# Altium schematic sheet Transceiver.SchDoc
size A3; Address1: Address1; Address2: Address2; Address3: Address3; Address4: Address4
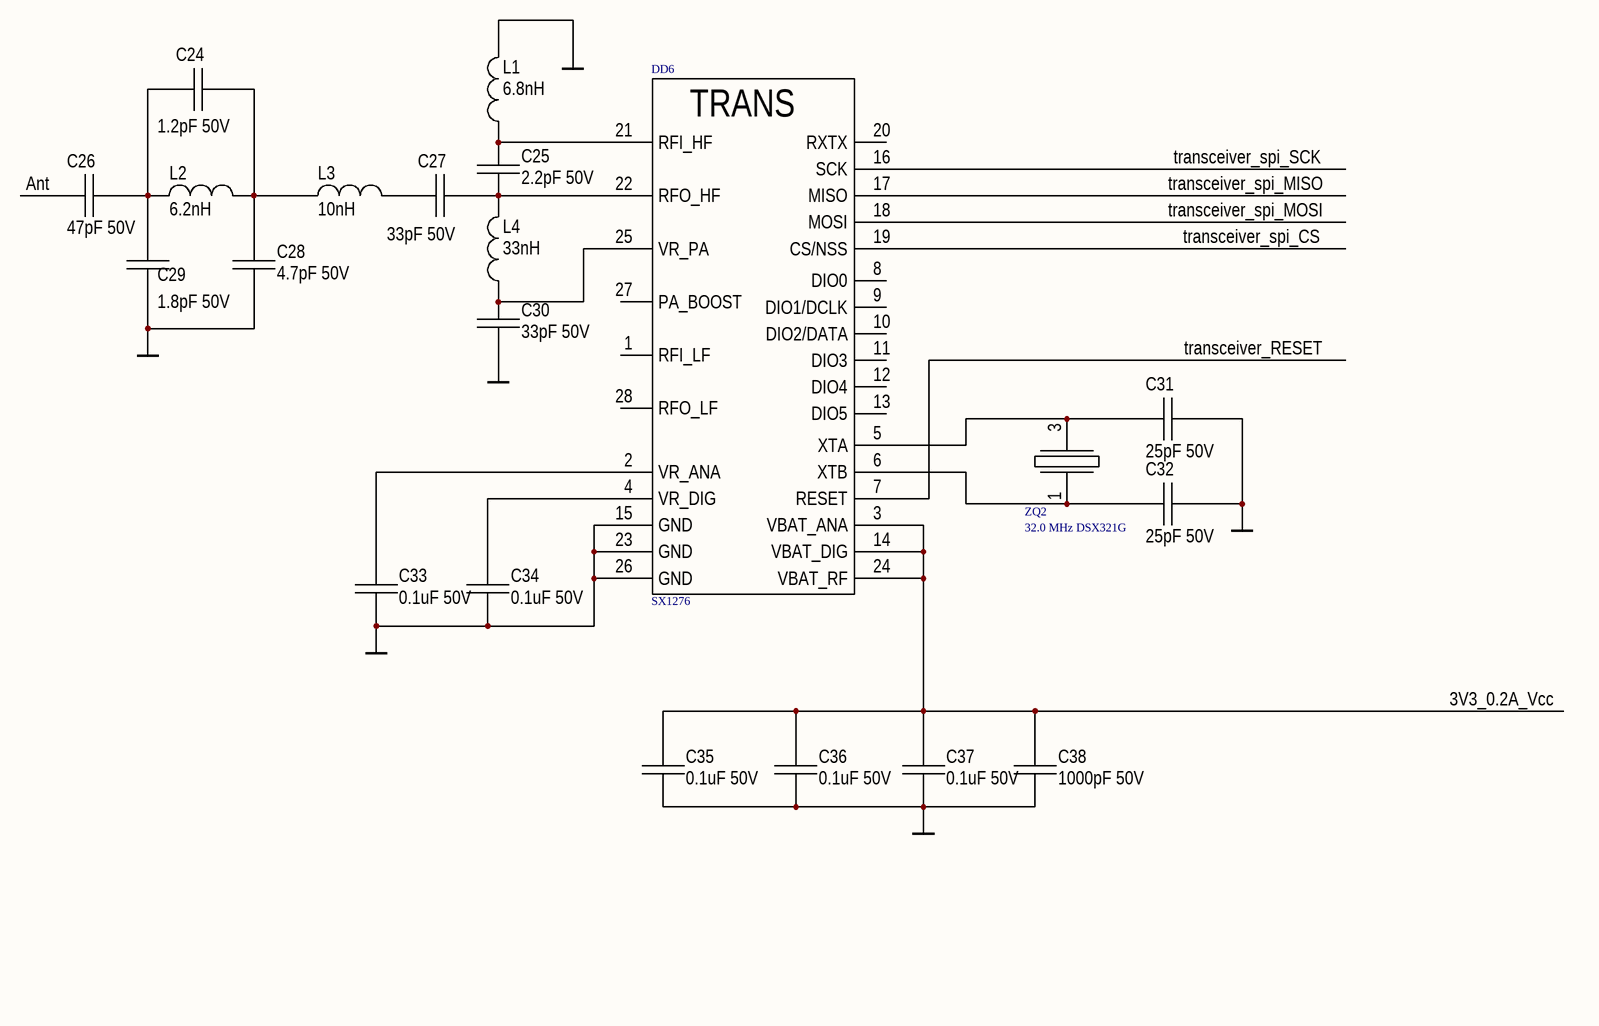
[diagram p0: Transceiver.SchDoc]

## Parts
C24  1.2pF 50V  [0603_CAP]
C25  2.2pF 50V  [0603_CAP]
C26  47pF 50V  [0603_CAP]
C27  33pF 50V  [0603_CAP]
C28  4.7pF 50V  [0603_CAP]
C29  1.8pF 50V  [0603_CAP]
C30  33pF 50V  [0603_CAP]
C31  25pF 50V  [0805_CAP]
C32  25pF 50V  [0805_CAP]
C33  0.1uF 50V  [0805_CAP]
C34  0.1uF 50V  [0805_CAP]
C35  0.1uF 50V  [0805_CAP]
C36  0.1uF 50V  [0805_CAP]
C37  0.1uF 50V  [0805_CAP]
C38  1000pF 50V  [0805_CAP]
DD6  SX1276  [qfn28]
L1  6.8nH  [0603_ind]
L2  6.2nH  [0603_ind]
L3  10nH  [0603_ind]
L4  33nH  [0603_ind]
ZQ2  32.0 MHz DSX321G  [gtxo-93]

## Nets
GND: C28.2 C29.1 C30.2 C31.2 C32.2 C33.1 C34.2 C35.2 C36.2 C37.2 C38.2 DD6.15(GND) DD6.23(GND) DD6.26(GND) L1.2
3V3_0.2A_Vcc: C35.1 C36.1 C37.1 C38.1 DD6.3(VBAT_ANA) DD6.14(VBAT_DIG) DD6.24(VBAT_RF)
Ant: C26.2
transceiver_RESET: DD6.7(RESET)
transceiver_spi_CS: DD6.19(CS/NSS)
transceiver_spi_MISO: DD6.17(MISO)
transceiver_spi_MOSI: DD6.18(MOSI)
transceiver_spi_SCK: DD6.16(SCK)
NetC24_1: C24.1 C26.1 C29.2 L2.1
NetC24_2: C24.2 C28.1 L2.2 L3.1
NetC25_1: C25.1 C27.1 DD6.22(RFO_HF) L4.2
NetC25_2: C25.2 DD6.21(RFI_HF) L1.1
NetC27_2: C27.2 L3.2
NetC30_1: C30.1 DD6.25(VR_PA) L4.1
NetC31_1: C31.1 DD6.5(XTA) ZQ2.3
NetC32_1: C32.1 DD6.6(XTB) ZQ2.1
NetC33_2: C33.2 DD6.2(VR_ANA)
NetC34_1: C34.1 DD6.4(VR_DIG)

Not connected (* = marked no-connect by the designer): DD6 1(RFI_LF) 8(DIO0) 9(DIO1/DCLK) 10(DIO2/DATA) 11(DIO3) 12(DIO4) 13(DIO5) 20(RXTX) 27(PA_BOOST) 28(RFO_LF)

## Notes on the sheet
- На место компонента С6 запаивается перемычка
- Title
- Size:
- Date:
- A3
- Number:
- Time:
- Revision:
- Sheet
- of
- File:
- (in symbol SX1276) TRANS

## Library data of the parts
C24-C38 = Cap_np
  C24: Value: 1.2pF 50V
  C25: Value: 2.2pF 50V
  C26: Value: 47pF 50V
  C27 C30: Value: 33pF 50V
  C28: Value: 4.7pF 50V
  C29: Value: 1.8pF 50V
  C31 C32: Value: 25pF 50V
  C33-C37: Value: 0.1uF 50V
  C38: Value: 1000pF 50V
L1-L4 = Inductor
  L1: Value: 6.8nH
  L2: Value: 6.2nH
  L3: Value: 10nH
  L4: Value: 33nH
ZQ2 = Cristall: Value: 32.0 MHz DSX321G
DD6 = SX1276: Value: SX1276